# EAGLE schematic breakout-ledpca9956b (EAGLE 9.3.2)
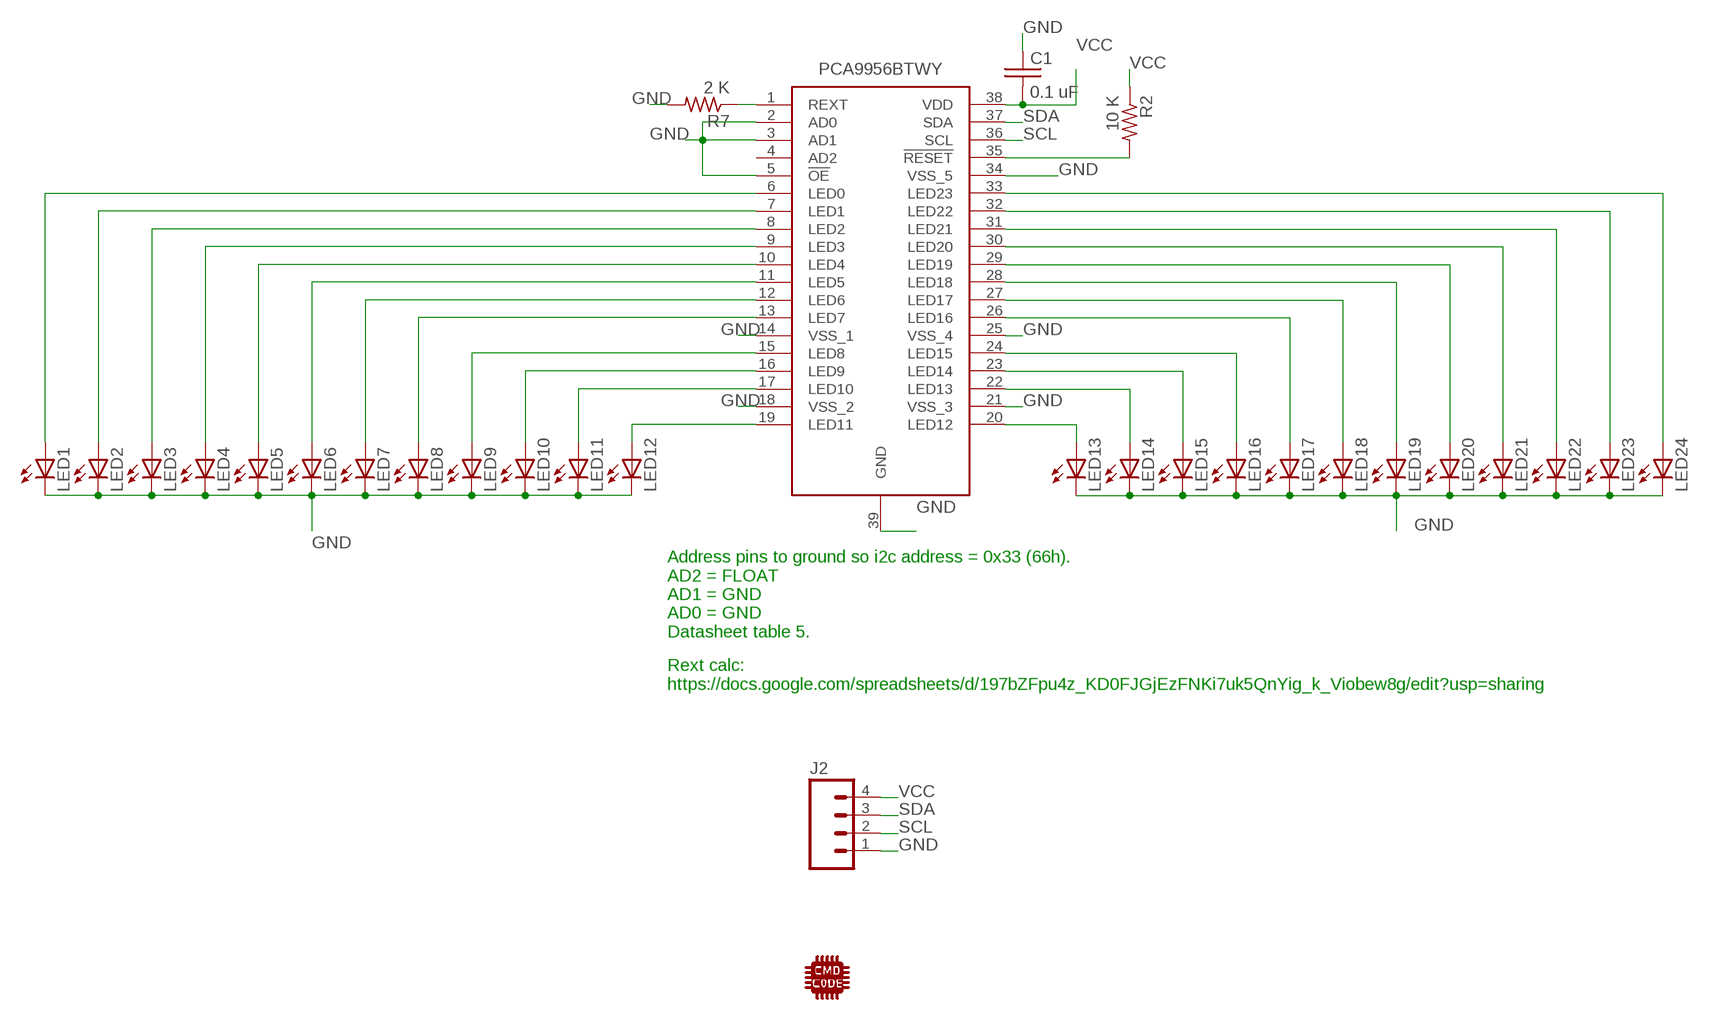
[diagram p0: schematic, sheet 1]

## Parts
C1  0.1 uF  C-USC0805  [C0805]
IC1  PCA9956BTWY  [SOP50P640X110-39N]
J2  M04PTH  [1X04]
LED1  LEDREVERSEMOUNT  [GULLWING_LED]
LED2  LEDREVERSEMOUNT  [GULLWING_LED]
LED3  LEDREVERSEMOUNT  [GULLWING_LED]
LED4  LEDREVERSEMOUNT  [GULLWING_LED]
LED5  LEDREVERSEMOUNT  [GULLWING_LED]
LED6  LEDREVERSEMOUNT  [GULLWING_LED]
LED7  LEDREVERSEMOUNT  [GULLWING_LED]
LED8  LEDREVERSEMOUNT  [GULLWING_LED]
LED9  LEDREVERSEMOUNT  [GULLWING_LED]
LED10  LEDREVERSEMOUNT  [GULLWING_LED]
LED11  LEDREVERSEMOUNT  [GULLWING_LED]
LED12  LEDREVERSEMOUNT  [GULLWING_LED]
LED13  LEDREVERSEMOUNT  [GULLWING_LED]
LED14  LEDREVERSEMOUNT  [GULLWING_LED]
LED15  LEDREVERSEMOUNT  [GULLWING_LED]
LED16  LEDREVERSEMOUNT  [GULLWING_LED]
LED17  LEDREVERSEMOUNT  [GULLWING_LED]
LED18  LEDREVERSEMOUNT  [GULLWING_LED]
LED19  LEDREVERSEMOUNT  [GULLWING_LED]
LED20  LEDREVERSEMOUNT  [GULLWING_LED]
LED21  LEDREVERSEMOUNT  [GULLWING_LED]
LED22  LEDREVERSEMOUNT  [GULLWING_LED]
LED23  LEDREVERSEMOUNT  [GULLWING_LED]
LED24  LEDREVERSEMOUNT  [GULLWING_LED]
R2  10 K  R-US_R0805  [R0805]
R7  2 K  R-US_R0805  [R0805]
U$2  CMD_C0DE_LOGO  [CMD_C0DE_LOGO]

## Nets
GND: C1.1 IC1.2(AD0) IC1.3(AD1) IC1.5(!OE) IC1.14(VSS_1) IC1.18(VSS_2) IC1.21(VSS_3) IC1.25(VSS_4) IC1.34(VSS_5) IC1.39(GND) J2.1 LED1.C LED2.C LED3.C LED4.C LED5.C LED6.C LED7.C LED8.C LED9.C LED10.C LED11.C LED12.C LED13.C LED14.C LED15.C LED16.C LED17.C LED18.C LED19.C LED20.C LED21.C LED22.C LED23.C LED24.C R7.2
N$1: IC1.6(LED0) LED1.A
N$2: IC1.7(LED1) LED2.A
N$3: IC1.8(LED2) LED3.A
N$4: IC1.9(LED3) LED4.A
N$5: IC1.10(LED4) LED5.A
N$6: IC1.11(LED5) LED6.A
N$7: IC1.12(LED6) LED7.A
N$8: IC1.13(LED7) LED8.A
N$9: IC1.15(LED8) LED9.A
N$10: IC1.16(LED9) LED10.A
N$11: IC1.17(LED10) LED11.A
N$12: IC1.19(LED11) LED12.A
N$13: IC1.20(LED12) LED13.A
N$14: IC1.22(LED13) LED14.A
N$15: IC1.23(LED14) LED15.A
N$16: IC1.24(LED15) LED16.A
N$17: IC1.26(LED16) LED17.A
N$18: IC1.27(LED17) LED18.A
N$19: IC1.28(LED18) LED19.A
N$20: IC1.29(LED19) LED20.A
N$21: IC1.30(LED20) LED21.A
N$22: IC1.31(LED21) LED22.A
N$23: IC1.32(LED22) LED23.A
N$24: IC1.33(LED23) LED24.A
N$35: IC1.1(REXT) R7.1
N$36: IC1.35(!RESET) R2.2
SCL: IC1.36(SCL) J2.2
SDA: IC1.37(SDA) J2.3
VCC: C1.2 IC1.38(VDD) J2.4 R2.1
Unconnected: IC1.4(AD2)

## Notes on the sheet
- Address pins to ground so i2c address = 0x33 (66h). 
  AD2 = FLOAT
  AD1 = GND
  AD0 = GND
  Datasheet table 5.
- Rext calc:
  https://docs.google.com/spreadsheets/d/197bZFpu4z_KD0FJGjEzFNKi7uk5QnYig_k_Viobew8g/edit?usp=sharing

## Library data of the parts
C1 = passives:C-US: CAPACITOR, American symbol
IC1 = PCA9956BTWY:PCA9956BTWY: NXP - PCA9956BTWY - LED DRIVER, CONSTANT CURRENT, HTSSOP-38 Source: Datasheet <https://www.mouser.be/datasheet/2/302/PCA9956B-1127643.pdf>; DESCRIPTION: NXP - PCA9956BTWY - LED DRIVER, CONSTANT CURRENT, HTSSOP-38; HEIGHT: 1.1mm; MANUFACTURER_NAME: NXP; MANUFACTURER_PART_NUMBER: PCA9956BTWY; MOUSER_PART_NUMBER: 771-PCA9956BTWY
J2 = connector:M04: Header 4 Standard 4-pin 0.1" header. Use with straight break away headers (SKU : PRT-00116), right angle break away headers (PRT-00553), swiss pins (PRT-00743), machine pins (PRT-00117), and female headers (PRT-00115). Molex polarized connector foot print use with SKU : PRT-08231 with associated crimp pins and housings. 1MM SMD Version SKU: PRT-10208; PROD_ID: CONN-09696
LED1-LED24 = leds:LED: LEDs Standard schematic elements and footprints for 5mm, 3mm, 1206, and 0603 sized LEDs. 5mm - Spark Fun Electronics SKU : COM-00529 (and others)
R2 R7 = darknet_parts_library:R-US_: RESISTOR, American symbol
U$2 = logos:CMD_C0DE_LOGO